# Altium project PMT_8500.PrjPcb
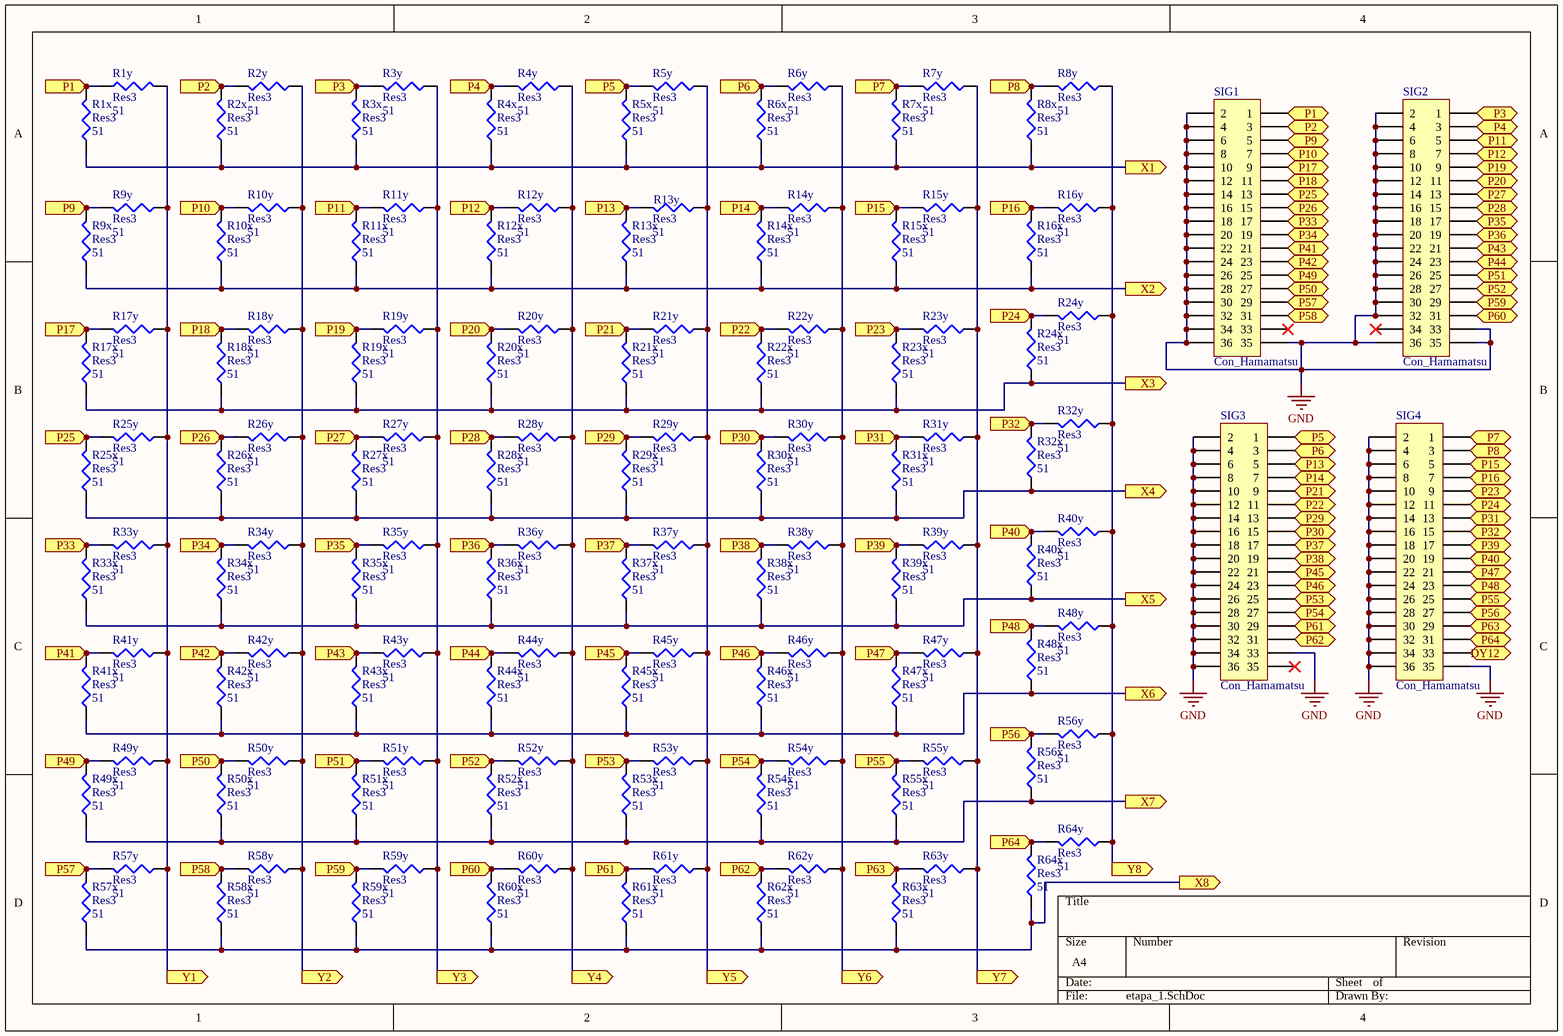
[diagram p0: etapa_1.SchDoc]
4 sheets, 286 parts. Net scope: flat (ports and power ports of the same name join across sheets).
Board file: etapa_1_v2.PcbDoc
Sheets:
  etapa_1.SchDoc
  etapa1_suma.SchDoc
  etapa1_anger_X.SchDoc
  etapa1_anger_Y.SchDoc

## Sheet etapa_1.SchDoc
size A4

### Parts
R1x  Res3  value 51  [0402]
R1y  Res3  value 51  [0402]
R2x  Res3  value 51  [0402]
R2y  Res3  value 51  [0402]
R3x  Res3  value 51  [0402]
R3y  Res3  value 51  [0402]
R4x  Res3  value 51  [0402]
R4y  Res3  value 51  [0402]
R5x  Res3  value 51  [0402]
R5y  Res3  value 51  [0402]
R6x  Res3  value 51  [0402]
R6y  Res3  value 51  [0402]
R7x  Res3  value 51  [0402]
R7y  Res3  value 51  [0402]
R8x  Res3  value 51  [0402]
R8y  Res3  value 51  [0402]
R9x  Res3  value 51  [0402]
R9y  Res3  value 51  [0402]
R10x  Res3  value 51  [0402]
R10y  Res3  value 51  [0402]
R11x  Res3  value 51  [0402]
R11y  Res3  value 51  [0402]
R12x  Res3  value 51  [0402]
R12y  Res3  value 51  [0402]
R13x  Res3  value 51  [0402]
R13y  Res3  value 51  [0402]
R14x  Res3  value 51  [0402]
R14y  Res3  value 51  [0402]
R15x  Res3  value 51  [0402]
R15y  Res3  value 51  [0402]
R16x  Res3  value 51  [0402]
R16y  Res3  value 51  [0402]
R17x  Res3  value 51  [0402]
R17y  Res3  value 51  [0402]
R18x  Res3  value 51  [0402]
R18y  Res3  value 51  [0402]
R19x  Res3  value 51  [0402]
R19y  Res3  value 51  [0402]
R20x  Res3  value 51  [0402]
R20y  Res3  value 51  [0402]
R21x  Res3  value 51  [0402]
R21y  Res3  value 51  [0402]
R22x  Res3  value 51  [0402]
R22y  Res3  value 51  [0402]
R23x  Res3  value 51  [0402]
R23y  Res3  value 51  [0402]
R24x  Res3  value 51  [0402]
R24y  Res3  value 51  [0402]
R25x  Res3  value 51  [0402]
R25y  Res3  value 51  [0402]
R26x  Res3  value 51  [0402]
R26y  Res3  value 51  [0402]
R27x  Res3  value 51  [0402]
R27y  Res3  value 51  [0402]
R28x  Res3  value 51  [0402]
R28y  Res3  value 51  [0402]
R29x  Res3  value 51  [0402]
R29y  Res3  value 51  [0402]
R30x  Res3  value 51  [0402]
R30y  Res3  value 51  [0402]
R31x  Res3  value 51  [0402]
R31y  Res3  value 51  [0402]
R32x  Res3  value 51  [0402]
R32y  Res3  value 51  [0402]
R33x  Res3  value 51  [0402]
R33y  Res3  value 51  [0402]
R34x  Res3  value 51  [0402]
R34y  Res3  value 51  [0402]
R35x  Res3  value 51  [0402]
R35y  Res3  value 51  [0402]
R36x  Res3  value 51  [0402]
R36y  Res3  value 51  [0402]
R37x  Res3  value 51  [0402]
R37y  Res3  value 51  [0402]
R38x  Res3  value 51  [0402]
R38y  Res3  value 51  [0402]
R39x  Res3  value 51  [0402]
R39y  Res3  value 51  [0402]
R40x  Res3  value 51  [0402]
R40y  Res3  value 51  [0402]
R41x  Res3  value 51  [0402]
R41y  Res3  value 51  [0402]
R42x  Res3  value 51  [0402]
R42y  Res3  value 51  [0402]
R43x  Res3  value 51  [0402]
R43y  Res3  value 51  [0402]
R44x  Res3  value 51  [0402]
R44y  Res3  value 51  [0402]
R45x  Res3  value 51  [0402]
R45y  Res3  value 51  [0402]
R46x  Res3  value 51  [0402]
R46y  Res3  value 51  [0402]
R47x  Res3  value 51  [0402]
R47y  Res3  value 51  [0402]
R48x  Res3  value 51  [0402]
R48y  Res3  value 51  [0402]
R49x  Res3  value 51  [0402]
R49y  Res3  value 51  [0402]
R50x  Res3  value 51  [0402]
R50y  Res3  value 51  [0402]
R51x  Res3  value 51  [0402]
R51y  Res3  value 51  [0402]
R52x  Res3  value 51  [0402]
R52y  Res3  value 51  [0402]
R53x  Res3  value 51  [0402]
R53y  Res3  value 51  [0402]
R54x  Res3  value 51  [0402]
R54y  Res3  value 51  [0402]
R55x  Res3  value 51  [0402]
R55y  Res3  value 51  [0402]
R56x  Res3  value 51  [0402]
R56y  Res3  value 51  [0402]
R57x  Res3  value 51  [0402]
R57y  Res3  value 51  [0402]
R58x  Res3  value 51  [0402]
R58y  Res3  value 51  [0402]
R59x  Res3  value 51  [0402]
R59y  Res3  value 51  [0402]
R60x  Res3  value 51  [0402]
R60y  Res3  value 51  [0402]
R61x  Res3  value 51  [0402]
R61y  Res3  value 51  [0402]
R62x  Res3  value 51  [0402]
R62y  Res3  value 51  [0402]
R63x  Res3  value 51  [0402]
R63y  Res3  value 51  [0402]
R64x  Res3  value 51  [0402]
R64y  Res3  value 51  [0402]
SIG1  Con_Hamamatsu  [SQW-118-2]
SIG2  Con_Hamamatsu  [SQW-118-2]
SIG3  Con_Hamamatsu  [SQW-118-2]
SIG4  Con_Hamamatsu  [SQW-118-2]

### Ports
DY12 (out), P1 (in), P1 (out), P2 (in), P2 (out), P3 (in), P3 (out), P4 (in), P4 (out), P5 (in), P5 (out), P6 (in), P6 (out), P7 (in), P7 (out), P8 (in), P8 (out), P9 (in), P9 (out), P10 (in), P10 (out), P11 (in), P11 (out), P12 (in), P12 (out), P13 (in), P13 (out), P14 (in), P14 (out), P15 (in), P15 (out), P16 (in), P16 (out), P17 (in), P17 (out), P18 (in), P18 (out), P19 (in), P19 (out), P20 (in), P20 (out), P21 (in), P21 (out), P22 (in), P22 (out), P23 (in), P23 (out), P24 (in), P24 (out), P25 (in), P25 (out), P26 (in), P26 (out), P27 (in), P27 (out), P28 (in), P28 (out), P29 (in), P29 (out), P30 (in), P30 (out), P31 (in), P31 (out), P32 (in), P32 (out), P33 (in), P33 (out), P34 (in), P34 (out), P35 (in), P35 (out), P36 (in), P36 (out), P37 (in), P37 (out), P38 (in), P38 (out), P39 (in), P39 (out), P40 (in), P40 (out), P41 (in), P41 (out), P42 (in), P42 (out), P43 (in), P43 (out), P44 (in), P44 (out), P45 (in), P45 (out), P46 (in), P46 (out), P47 (in), P47 (out), P48 (in), P48 (out), P49 (in), P49 (out), P50 (in), P50 (out), P51 (in), P51 (out), P52 (in), P52 (out), P53 (in), P53 (out), P54 (in), P54 (out), P55 (in), P55 (out), P56 (in), P56 (out), P57 (in), P57 (out), P58 (in), P58 (out), P59 (in), P59 (out), P60 (in), P60 (out), P61 (in), P61 (out), P62 (in), P62 (out), P63 (in), P63 (out), P64 (in), P64 (out), X1 (out), X2 (out), X3 (out), X4 (out), X5 (out), X6 (out), X7 (out), X8 (out), Y1 (out), Y2 (out), Y3 (out), Y4 (out), Y5 (out), Y6 (out), Y7 (out), Y8 (out)

### Nets
GND: SIG1.2 SIG1.4 SIG1.6 SIG1.8 SIG1.10 SIG1.12 SIG1.14 SIG1.16 SIG1.18 SIG1.20 SIG1.22 SIG1.24 SIG1.26 SIG1.28 SIG1.30 SIG1.32 SIG1.34 SIG1.35 SIG1.36 SIG2.2 SIG2.4 SIG2.6 SIG2.8 SIG2.10 SIG2.12 SIG2.14 SIG2.16 SIG2.18 SIG2.20 SIG2.22 SIG2.24 SIG2.26 SIG2.28 SIG2.30 SIG2.32 SIG2.33 SIG2.35 SIG2.36 SIG3.2 SIG3.4 SIG3.6 SIG3.8 SIG3.10 SIG3.12 SIG3.14 SIG3.16 SIG3.18 SIG3.20 SIG3.22 SIG3.24 SIG3.26 SIG3.28 SIG3.30 SIG3.32 SIG3.33 SIG3.34 SIG3.36 SIG4.2 SIG4.4 SIG4.6 SIG4.8 SIG4.10 SIG4.12 SIG4.14 SIG4.16 SIG4.18 SIG4.20 SIG4.22 SIG4.24 SIG4.26 SIG4.28 SIG4.30 SIG4.32 SIG4.34 SIG4.35 SIG4.36
NetR1_1: R1x.1 R2x.1 R3x.1 R4x.1 R5x.1 R6x.1 R7x.1 R8x.1 ; port X1
NetR1x_2: R1x.2 R1y.1 SIG1.1 ; port P1
NetR1y_2: R1y.2 R9y.1 R17y.1 R25y.1 R33y.1 R41y.1 R49y.1 R57y.1 ; port Y1
NetR2_1: R9x.1 R10x.1 R11x.1 R12x.1 R13x.1 R14x.1 R15x.1 R16x.1 ; port X2
NetR2x_2: R2x.2 R2y.2 SIG1.3 ; port P2
NetR2y_1: R2y.1 R10y.1 R18y.1 R26y.1 R34y.1 R42y.1 R50y.1 R58y.1 ; port Y2
NetR3_1: R17x.1 R18x.1 R19x.1 R20x.1 R21x.1 R22x.1 R23x.1 R24x.1 ; port X3
NetR3x_2: R3x.2 R3y.2 SIG2.1 ; port P3
NetR3y_1: R3y.1 R11y.1 R19y.1 R27y.1 R35y.1 R43y.1 R51y.1 R59y.1 ; port Y3
NetR4_1: R25x.1 R26x.1 R27x.1 R28x.1 R29x.1 R30x.1 R31x.1 R32x.1 ; port X4
NetR4x_2: R4x.2 R4y.2 SIG2.3 ; port P4
NetR4y_1: R4y.1 R12y.1 R20y.1 R28y.1 R36y.1 R44y.1 R52y.1 R60y.1 ; port Y4
NetR5_1: R33x.1 R34x.1 R35x.1 R36x.1 R37x.1 R38x.1 R39x.1 R40x.1 ; port X5
NetR5x_2: R5x.2 R5y.2 SIG3.1 ; port P5
NetR5y_1: R5y.1 R13y.1 R21y.1 R29y.1 R37y.1 R45y.1 R53y.1 R61y.1 ; port Y5
NetR6_1: R41x.1 R42x.1 R43x.1 R44x.1 R45x.1 R46x.1 R47x.1 R48x.1 ; port X6
NetR6x_2: R6x.2 R6y.2 SIG3.3 ; port P6
NetR6y_1: R6y.1 R14y.1 R22y.1 R30y.1 R38y.1 R46y.1 R54y.1 R62y.1 ; port Y6
NetR7_1: R49x.1 R50x.1 R51x.1 R52x.1 R53x.1 R54x.1 R55x.1 R56x.1 ; port X7
NetR7x_2: R7x.2 R7y.2 SIG4.1 ; port P7
NetR7y_1: R7y.1 R15y.1 R23y.1 R31y.1 R39y.1 R47y.1 R55y.1 R63y.1 ; port Y7
NetR8_1: R57x.1 R58x.1 R59x.1 R60x.1 R61x.1 R62x.1 R63x.1 R64x.1 ; port X8
NetR8x_2: R8x.2 R8y.2 SIG4.3 ; port P8
NetR8y_1: R8y.1 R16y.1 R24y.1 R32y.1 R40y.1 R48y.1 R56y.1 R64y.1 ; port Y8
NetR9x_2: R9x.2 R9y.2 SIG1.5 ; port P9
NetR10x_2: R10x.2 R10y.2 SIG1.7 ; port P10
NetR11x_2: R11x.2 R11y.2 SIG2.5 ; port P11
NetR12x_2: R12x.2 R12y.2 SIG2.7 ; port P12
NetR13x_2: R13x.2 R13y.2 SIG3.5 ; port P13
NetR14x_2: R14x.2 R14y.2 SIG3.7 ; port P14
NetR15x_2: R15x.2 R15y.2 SIG4.5 ; port P15
NetR16x_2: R16x.2 R16y.2 SIG4.7 ; port P16
NetR17_2: SIG4.33 ; port DY12
NetR17x_2: R17x.2 R17y.2 SIG1.9 ; port P17
NetR18x_2: R18x.2 R18y.2 SIG1.11 ; port P18
NetR19x_2: R19x.2 R19y.2 SIG2.9 ; port P19
NetR20x_2: R20x.2 R20y.2 SIG2.11 ; port P20
NetR21x_2: R21x.2 R21y.2 SIG3.9 ; port P21
NetR22x_2: R22x.2 R22y.2 SIG3.11 ; port P22
NetR23x_2: R23x.2 R23y.2 SIG4.9 ; port P23
NetR24x_2: R24x.2 R24y.2 SIG4.11 ; port P24
NetR25x_2: R25x.2 R25y.2 SIG1.13 ; port P25
NetR26x_2: R26x.2 R26y.2 SIG1.15 ; port P26
NetR27x_2: R27x.2 R27y.2 SIG2.13 ; port P27
NetR28x_2: R28x.2 R28y.2 SIG2.15 ; port P28
NetR29x_2: R29x.2 R29y.2 SIG3.13 ; port P29
NetR30x_2: R30x.2 R30y.2 SIG3.15 ; port P30
NetR31x_2: R31x.2 R31y.2 SIG4.13 ; port P31
NetR32x_2: R32x.2 R32y.2 SIG4.15 ; port P32
NetR33x_2: R33x.2 R33y.2 SIG1.17 ; port P33
NetR34x_2: R34x.2 R34y.2 SIG1.19 ; port P34
NetR35x_2: R35x.2 R35y.2 SIG2.17 ; port P35
NetR36x_2: R36x.2 R36y.2 SIG2.19 ; port P36
NetR37x_2: R37x.2 R37y.2 SIG3.17 ; port P37
NetR38x_2: R38x.2 R38y.2 SIG3.19 ; port P38
NetR39x_2: R39x.2 R39y.2 SIG4.17 ; port P39
NetR40x_2: R40x.2 R40y.2 SIG4.19 ; port P40
NetR41x_2: R41x.2 R41y.2 SIG1.21 ; port P41
NetR42x_2: R42x.2 R42y.2 SIG1.23 ; port P42
NetR43x_2: R43x.2 R43y.2 SIG2.21 ; port P43
NetR44x_2: R44x.2 R44y.2 SIG2.23 ; port P44
NetR45x_2: R45x.2 R45y.2 SIG3.21 ; port P45
NetR46x_2: R46x.2 R46y.2 SIG3.23 ; port P46
NetR47x_2: R47x.2 R47y.2 SIG4.21 ; port P47
NetR48x_2: R48x.2 R48y.2 SIG4.23 ; port P48
NetR49x_2: R49x.2 R49y.2 SIG1.25 ; port P49
NetR50x_2: R50x.2 R50y.2 SIG1.27 ; port P50
NetR51x_2: R51x.2 R51y.2 SIG2.25 ; port P51
NetR52x_2: R52x.2 R52y.2 SIG2.27 ; port P52
NetR53x_2: R53x.2 R53y.2 SIG3.25 ; port P53
NetR54x_2: R54x.2 R54y.2 SIG3.27 ; port P54
NetR55x_2: R55x.2 R55y.2 SIG4.25 ; port P55
NetR56x_2: R56x.2 R56y.2 SIG4.27 ; port P56
NetR57x_2: R57x.2 R57y.2 SIG1.29 ; port P57
NetR58x_2: R58x.2 R58y.2 SIG1.31 ; port P58
NetR59x_2: R59x.2 R59y.2 SIG2.29 ; port P59
NetR60x_2: R60x.2 R60y.2 SIG2.31 ; port P60
NetR61x_2: R61x.2 R61y.2 SIG3.29 ; port P61
NetR62x_2: R62x.2 R62y.2 SIG3.31 ; port P62
NetR63x_2: R63x.2 R63y.2 SIG4.29 ; port P63
NetR64x_2: R64x.2 R64y.2 SIG4.31 ; port P64

Not connected (* = marked no-connect by the designer): SIG1 33*; SIG2 34*; SIG3 35*

### Library data of the parts
R1x R1y R2x R2y R3x R3y R4x R4y R5x R5y R6x R6y R7x R7y R8x R8y R9x R9y R10x R10y R11x R11y R12x R12y R13x R13y R14x R14y R15x R15y R16x R16y R17x R17y R18x R18y R19x R19y R20x R20y R21x R21y R22x R22y R23x R23y R24x R24y R25x R25y R26x R26y R27x R27y R28x R28y R29x R29y R30x R30y R31x R31y R32x R32y R33x R33y R34x R34y R35x R35y R36x R36y R37x R37y R38x R38y R39x R39y R40x R40y R41x R41y R42x R42y R43x R43y R44x R44y R45x R45y R46x R46y R47x R47y R48x R48y R49x R49y R50x R50y R51x R51y R52x R52y R53x R53y R54x R54y R55x R55y R56x R56y R57x R57y R58x R58y R59x R59y R60x R60y R61x R61y R62x R62y R63x R63y R64x R64y = Res3: Resistor; Published: 8-Jun-2000; LatestRevisionDate: 29-May-2009; LatestRevisionNote: IPC-7351 Footprint Added.; PackageReference: J1-0603; Publisher: Altium Limited; PackageDescription: Chip Resistor

## Sheet etapa1_suma.SchDoc
size A4
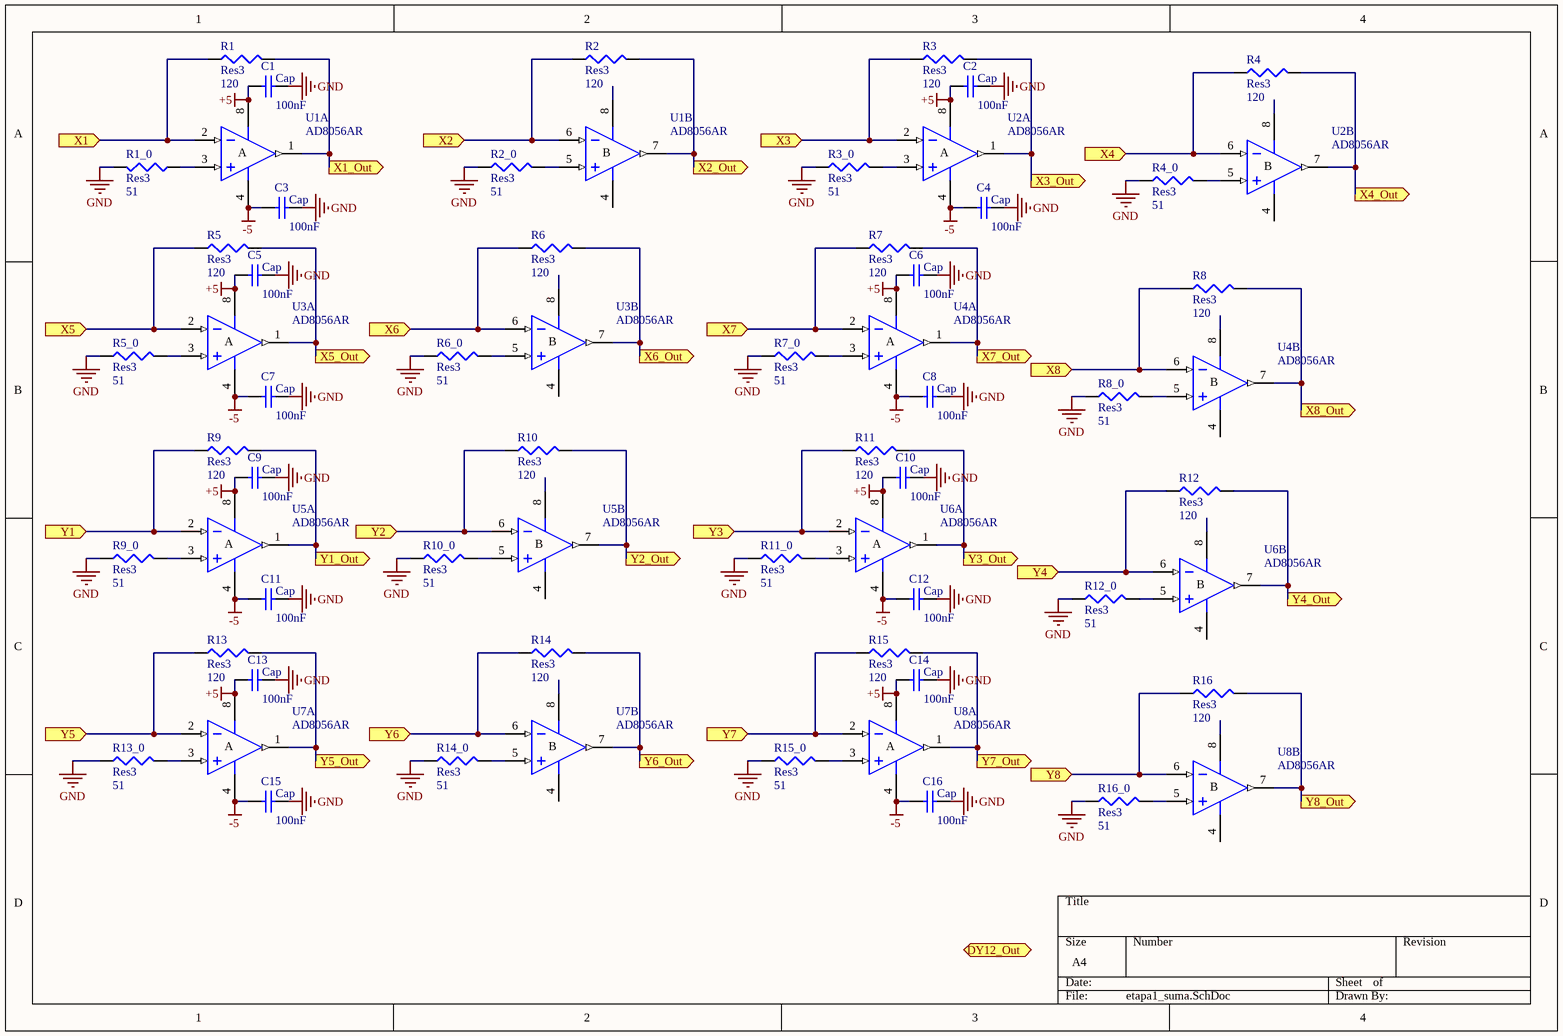
[diagram p1: etapa1_suma.SchDoc]

### Parts
C1  Cap  value 100nF  [1608[0603]]
C2  Cap  value 100nF  [1608[0603]]
C3  Cap  value 100nF  [1608[0603]]
C4  Cap  value 100nF  [1608[0603]]
C5  Cap  value 100nF  [1608[0603]]
C6  Cap  value 100nF  [1608[0603]]
C7  Cap  value 100nF  [1608[0603]]
C8  Cap  value 100nF  [1608[0603]]
C9  Cap  value 100nF  [1608[0603]]
C10  Cap  value 100nF  [1608[0603]]
C11  Cap  value 100nF  [1608[0603]]
C12  Cap  value 100nF  [1608[0603]]
C13  Cap  value 100nF  [1608[0603]]
C14  Cap  value 100nF  [1608[0603]]
C15  Cap  value 100nF  [1608[0603]]
C16  Cap  value 100nF  [1608[0603]]
R1  Res3  value 120  [0402]
R1_0  Res3  value 51  [0402]
R2  Res3  value 120  [0402]
R2_0  Res3  value 51  [0402]
R3  Res3  value 120  [0402]
R3_0  Res3  value 51  [0402]
R4  Res3  value 120  [0402]
R4_0  Res3  value 51  [0402]
R5  Res3  value 120  [0402]
R5_0  Res3  value 51  [0402]
R6  Res3  value 120  [0402]
R6_0  Res3  value 51  [0402]
R7  Res3  value 120  [0402]
R7_0  Res3  value 51  [0402]
R8  Res3  value 120  [0402]
R8_0  Res3  value 51  [0402]
R9  Res3  value 120  [0402]
R9_0  Res3  value 51  [0402]
R10  Res3  value 120  [0402]
R10_0  Res3  value 51  [0402]
R11  Res3  value 120  [0402]
R11_0  Res3  value 51  [0402]
R12  Res3  value 120  [0402]
R12_0  Res3  value 51  [0402]
R13  Res3  value 120  [0402]
R13_0  Res3  value 51  [0402]
R14  Res3  value 120  [0402]
R14_0  Res3  value 51  [0402]
R15  Res3  value 120  [0402]
R15_0  Res3  value 51  [0402]
R16  Res3  value 120  [0402]
R16_0  Res3  value 51  [0402]
U1  AD8056AR  [RM-8]  (parts A,B of 2)
U2  AD8056AR  [RM-8]  (parts A,B of 2)
U3  AD8056AR  [RM-8]  (parts A,B of 2)
U4  AD8056AR  [RM-8]  (parts A,B of 2)
U5  AD8056AR  [RM-8]  (parts A,B of 2)
U6  AD8056AR  [RM-8]  (parts A,B of 2)
U7  AD8056AR  [RM-8]  (parts A,B of 2)
U8  AD8056AR  [RM-8]  (parts A,B of 2)

### Ports
DY12_Out (out), X1 (in), X1_Out (out), X2 (in), X2_Out (out), X3 (in), X3_Out (out), X4 (in), X4_Out (out), X5 (in), X5_Out (out), X6 (in), X6_Out (out), X7 (in), X7_Out (out), X8 (in), X8_Out (out), Y1 (in), Y1_Out (out), Y2 (in), Y2_Out (out), Y3 (in), Y3_Out (out), Y4 (in), Y4_Out (out), Y5 (in), Y5_Out (out), Y6 (in), Y6_Out (out), Y7 (in), Y7_Out (out), Y8 (in), Y8_Out (out)

### Nets
+5: C1.2 C2.2 C5.2 C6.2 C9.2 C10.2 C13.2 C14.2 U1.8(V+) U2.8(V+) U3.8(V+) U4.8(V+) U5.8(V+) U6.8(V+) U7.8(V+) U8.8(V+)
-5: C3.2 C4.2 C7.2 C8.2 C11.2 C12.2 C15.2 C16.2 U1.4(V-) U2.4(V-) U3.4(V-) U4.4(V-) U5.4(V-) U6.4(V-) U7.4(V-) U8.4(V-)
GND: C1.1 C2.1 C3.1 C4.1 C5.1 C6.1 C7.1 C8.1 C9.1 C10.1 C11.1 C12.1 C13.1 C14.1 C15.1 C16.1 R1_0.2 R2_0.1 R3_0.1 R4_0.1 R5_0.1 R6_0.1 R7_0.1 R8_0.1 R9_0.1 R10_0.1 R11_0.1 R12_0.1 R13_0.1 R14_0.1 R15_0.1 R16_0.1
NetR1_0_1: R1_0.1 U1.3(IN+)
NetR1_1: R1.1 U1.2(IN-) ; port X1
NetR1_2: R1.2 U1.1(OUT) ; port X1_Out
NetR1y_2: R9.1 U5.2(IN-) ; port Y1
NetR2_0_2: R2_0.2 U1.5(IN+)
NetR2_1: R2.1 U1.6(IN-) ; port X2
NetR2_2: R2.2 U1.7(OUT) ; port X2_Out
NetR2y_1: R10.1 U5.6(IN-) ; port Y2
NetR3_0_2: R3_0.2 U2.3(IN+)
NetR3_1: R3.1 U2.2(IN-) ; port X3
NetR3_2: R3.2 U2.1(OUT) ; port X3_Out
NetR3y_1: R11.1 U6.2(IN-) ; port Y3
NetR4_0_2: R4_0.2 U2.5(IN+)
NetR4_1: R4.1 U2.6(IN-) ; port X4
NetR4_2: R4.2 U2.7(OUT) ; port X4_Out
NetR4y_1: R12.1 U6.6(IN-) ; port Y4
NetR5_0_2: R5_0.2 U3.3(IN+)
NetR5_1: R5.1 U3.2(IN-) ; port X5
NetR5_2: R5.2 U3.1(OUT) ; port X5_Out
NetR5y_1: R13.1 U7.2(IN-) ; port Y5
NetR6_0_2: R6_0.2 U3.5(IN+)
NetR6_1: R6.1 U3.6(IN-) ; port X6
NetR6_2: R6.2 U3.7(OUT) ; port X6_Out
NetR6y_1: R14.1 U7.6(IN-) ; port Y6
NetR7_0_2: R7_0.2 U4.3(IN+)
NetR7_1: R7.1 U4.2(IN-) ; port X7
NetR7_2: R7.2 U4.1(OUT) ; port X7_Out
NetR7y_1: R15.1 U8.2(IN-) ; port Y7
NetR8_0_2: R8_0.2 U4.5(IN+)
NetR8_1: R8.1 U4.6(IN-) ; port X8
NetR8_2: R8.2 U4.7(OUT) ; port X8_Out
NetR8y_1: R16.1 U8.6(IN-) ; port Y8
NetR9_0_2: R9_0.2 U5.3(IN+)
NetR9_2: R9.2 U5.1(OUT) ; port Y1_Out
NetR10_0_2: R10_0.2 U5.5(IN+)
NetR10_2: R10.2 U5.7(OUT) ; port Y2_Out
NetR11_0_2: R11_0.2 U6.3(IN+)
NetR11_2: R11.2 U6.1(OUT) ; port Y3_Out
NetR12_0_2: R12_0.2 U6.5(IN+)
NetR12_2: R12.2 U6.7(OUT) ; port Y4_Out
NetR13_0_2: R13_0.2 U7.3(IN+)
NetR13_2: R13.2 U7.1(OUT) ; port Y5_Out
NetR14_0_2: R14_0.2 U7.5(IN+)
NetR14_2: R14.2 U7.7(OUT) ; port Y6_Out
NetR15_0_2: R15_0.2 U8.3(IN+)
NetR15_2: R15.2 U8.1(OUT) ; port Y7_Out
NetR16_0_2: R16_0.2 U8.5(IN+)
NetR16_2: R16.2 U8.7(OUT) ; port Y8_Out

### Notes on the sheet
- (in symbol AD8056AR, part A) A
- (in symbol AD8056AR, part B) B

### Library data of the parts
C1-C16 = Cap: Capacitor; Published: 8-Jun-2000; LatestRevisionDate: 17-Jul-2002; LatestRevisionNote: Re-released for DXP Platform.; PackageReference: RAD-0.3; Publisher: Altium Limited; PackageDescription: Radial Cap, Thru-Hole; 2 Leads; 0.3 in Pin Spacing
R1 R1_0 R2 R2_0 R3 R3_0 R4 R4_0 R5 R5_0 R6 R6_0 R7 R7_0 R8 R8_0 R9 R9_0 R10 R10_0 R11 R11_0 R12 R12_0 R13 R13_0 R14 R14_0 R15 R15_0 R16 R16_0 = Res3: Resistor; Published: 8-Jun-2000; LatestRevisionDate: 29-May-2009; LatestRevisionNote: IPC-7351 Footprint Added.; PackageReference: J1-0603; Publisher: Altium Limited; PackageDescription: Chip Resistor
U1-U8 = AD8056AR: Low Cost, 300MHz Voltage Feedback Amplifier; Published: 8-Jun-2000; LatestRevisionDate: 13-Apr-2006; LatestRevisionNote: IPC-7351 Footprint Added.; DatasheetVersion: REV. 0 1997; PackageVersion: revA; PackageReference: SO-8; Publisher: Altium Limited; PackageDescription: 8-Pin Small Outline Integrated Circuit 1.27 mm Pitch; Code_JEDEC: MS-012-AA; Code_IPC: SOIC127P600-8; ComponentLink1Description: Manufacturer Link; ComponentLink1URL: http://www.analog.com/en/prod/0,,759_786_AD8055%2C00.html; ComponentLink2Description: Datasheet; ComponentLink2URL: http://www.analog.com/UploadedFiles/Data_Sheets/40402558757264AD8055_6_i.pdf

## Sheet etapa1_anger_X.SchDoc
size A4
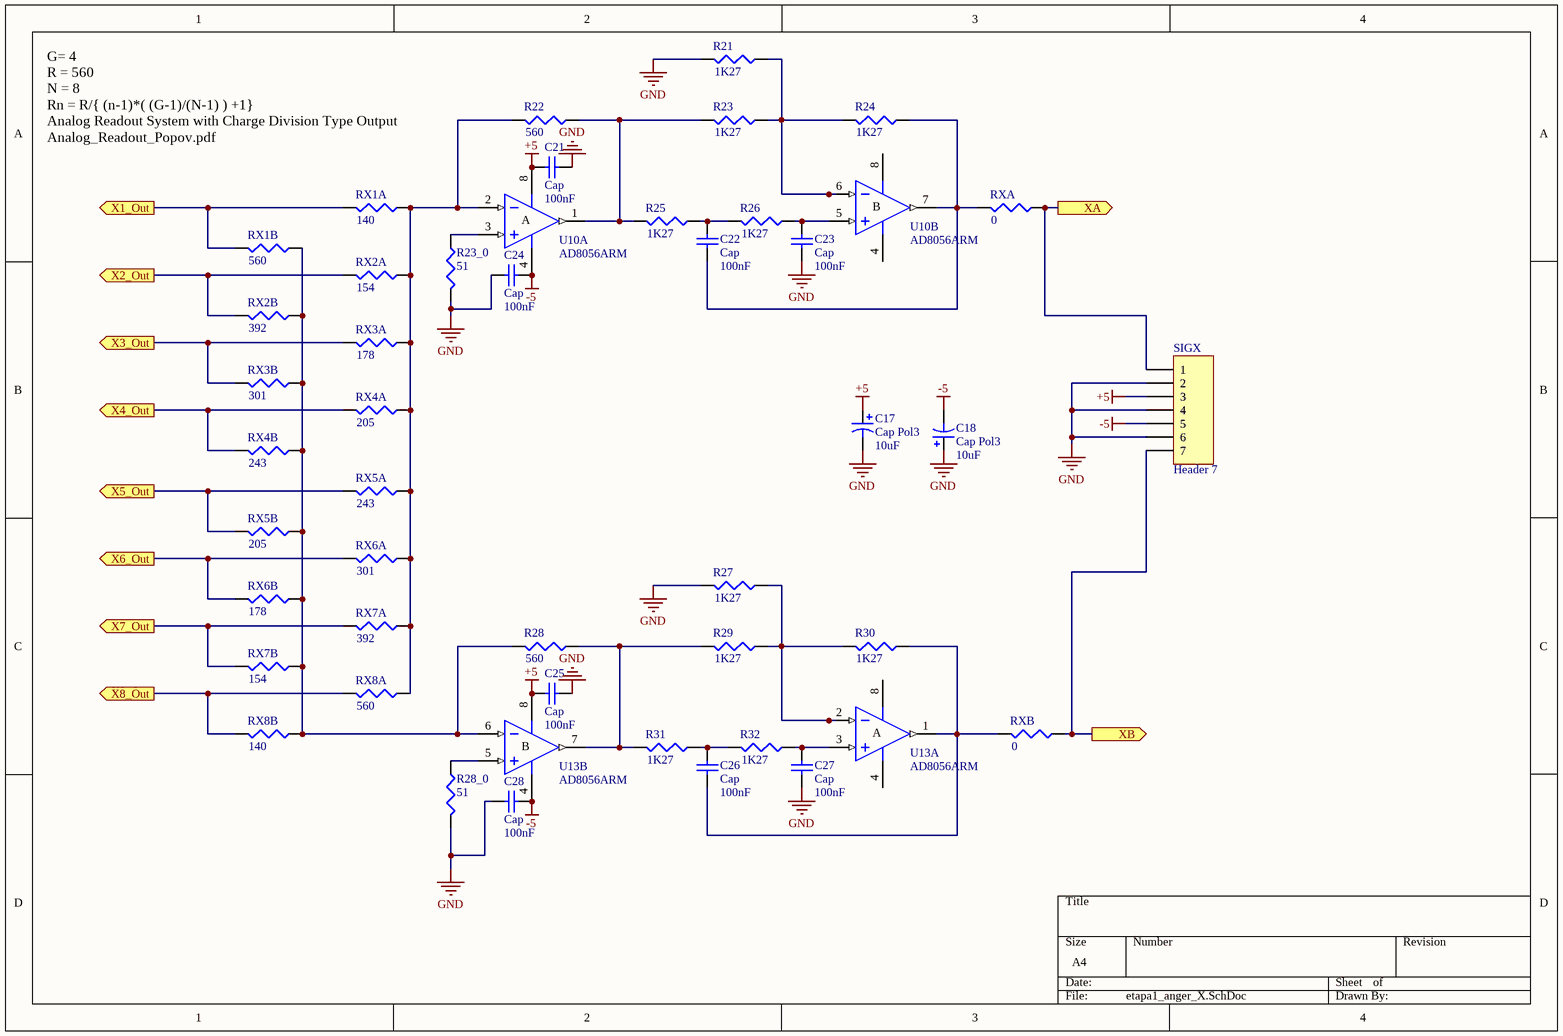
[diagram p2: etapa1_anger_X.SchDoc]

### Parts
C17  Cap Pol3  value 10uF  [C0805]
C18  Cap Pol3  value 10uF  [C0805]
C21  Cap  value 100nF  [1608[0603]]
C22  Cap  value 100nF  [1608[0603]]
C23  Cap  value 100nF  [1608[0603]]
C24  Cap  value 100nF  [1608[0603]]
C25  Cap  value 100nF  [1608[0603]]
C26  Cap  value 100nF  [1608[0603]]
C27  Cap  value 100nF  [1608[0603]]
C28  Cap  value 100nF  [1608[0603]]
R21  value 1K27  [1608[0603]]  (hidden comment: Res3)
R22  value 560  [0402]  (hidden comment: Res3)
R23  value 1K27  [0402]  (hidden comment: Res3)
R23_0  value 51  [0402]  (hidden comment: Res3)
R24  value 1K27  [0402]  (hidden comment: Res3)
R25  value 1K27  [0402]  (hidden comment: Res3)
R26  value 1K27  [0402]  (hidden comment: Res3)
R27  value 1K27  [1608[0603]]  (hidden comment: Res3)
R28  value 560  [0402]  (hidden comment: Res3)
R28_0  value 51  [0402]  (hidden comment: Res3)
R29  value 1K27  [0402]  (hidden comment: Res3)
R30  value 1K27  [0402]  (hidden comment: Res3)
R31  value 1K27  [0402]  (hidden comment: Res3)
R32  value 1K27  [0402]  (hidden comment: Res3)
RX1A  value 140  [0402]  (hidden comment: Res3)
RX1B  value 560  [0402]  (hidden comment: Res3)
RX2A  value 154  [0402]  (hidden comment: Res3)
RX2B  value 392  [0402]  (hidden comment: Res3)
RX3A  value 178  [0402]  (hidden comment: Res3)
RX3B  value 301  [0402]  (hidden comment: Res3)
RX4A  value 205  [0402]  (hidden comment: Res3)
RX4B  value 243  [0402]  (hidden comment: Res3)
RX5A  value 243  [0402]  (hidden comment: Res3)
RX5B  value 205  [0402]  (hidden comment: Res3)
RX6A  value 301  [0402]  (hidden comment: Res3)
RX6B  value 178  [0402]  (hidden comment: Res3)
RX7A  value 392  [0402]  (hidden comment: Res3)
RX7B  value 154  [0402]  (hidden comment: Res3)
RX8A  value 560  [0402]  (hidden comment: Res3)
RX8B  value 140  [0402]  (hidden comment: Res3)
RXA  value 0  [0402]  (hidden comment: Res3)
RXB  value 0  [0402]  (hidden comment: Res3)
SIGX  Header 7  [HDR1X7]
U10  AD8056ARM  [RM-8]  (parts A,B of 2)
U13  AD8056ARM  [RM-8]  (parts A,B of 2)

### Ports
X1_Out (out), X2_Out (out), X3_Out (out), X4_Out (out), X5_Out (out), X6_Out (out), X7_Out (out), X8_Out (out), XA (out), XB (out)

### Nets
+5: C17.1 C21.1 C25.1 SIGX.3 U10.8(V+) U13.8(V+)
-5: C18.2 C24.2 C28.2 SIGX.5 U10.4(V-) U13.4(V-)
GND: C17.2 C18.1 C21.2 C23.2 C24.1 C25.2 C27.2 C28.1 R21.2 R23_0.2 R27.2 R28_0.2 SIGX.2 SIGX.4 SIGX.6
NetC22_1: C22.1 R25.1 R26.2
NetC22_2: C22.2 R24.1 RXA.2 U10.7(OUT)
NetC23_1: C23.1 R26.1 U10.5(IN+)
NetC26_1: C26.1 R31.1 R32.2
NetC26_2: C26.2 R30.1 RXB.2 U13.1(OUT)
NetC27_1: C27.1 R32.1 U13.3(IN+)
NetR1_2: RX1A.2 RX1B.2 ; port X1_Out
NetR2_2: RX2A.2 RX2B.2 ; port X2_Out
NetR3_2: RX3A.2 RX3B.2 ; port X3_Out
NetR4_2: RX4A.2 RX4B.2 ; port X4_Out
NetR5_2: RX5A.2 RX5B.2 ; port X5_Out
NetR6_2: RX6A.2 RX6B.2 ; port X6_Out
NetR7_2: RX7A.2 RX7B.2 ; port X7_Out
NetR8_2: RX8A.2 RX8B.2 ; port X8_Out
NetR21_1: R21.1 R23.1 R24.2 U10.6(IN-)
NetR22_1: R22.1 R23.2 R25.2 U10.1(OUT)
NetR22_2: R22.2 RX1A.1 RX2A.1 RX3A.1 RX4A.1 RX5A.1 RX6A.1 RX7A.1 RX8A.1 U10.2(IN-)
NetR23_0_1: R23_0.1 U10.3(IN+)
NetR27_1: R27.1 R29.1 R30.2 U13.2(IN-)
NetR28_0_1: R28_0.1 U13.5(IN+)
NetR28_1: R28.1 R29.2 R31.2 U13.7(OUT)
NetR28_2: R28.2 RX1B.1 RX2B.1 RX3B.1 RX4B.1 RX5B.1 RX6B.1 RX7B.1 RX8B.1 U13.6(IN-)
NetRXA_1: RXA.1 SIGX.1 ; port XA
NetRXB_1: RXB.1 SIGX.7 ; port XB

### Notes on the sheet
- (near RX1A) G= 4
  R = 560
  N = 8
  Rn = R/{ (n-1)*( (G-1)/(N-1) ) +1}
  Analog Readout System with Charge Division Type Output
  Analog_Readout_Popov.pdf
- (in symbol AD8056ARM, part A) A
- (in symbol AD8056ARM, part B) B

### Library data of the parts
C17 C18 = Cap Pol3: Polarized Capacitor (Surface Mount); Published: 8-Jun-2000; LatestRevisionDate: 29-May-2009; LatestRevisionNote: IPC-7351 Footprint Added.; PackageReference: C0805; Publisher: Altium Limited; PackageDescription: Chip Capacitor
C21-C28 = Cap: Capacitor; Published: 8-Jun-2000; LatestRevisionDate: 17-Jul-2002; LatestRevisionNote: Re-released for DXP Platform.; PackageReference: RAD-0.3; Publisher: Altium Limited; PackageDescription: Radial Cap, Thru-Hole; 2 Leads; 0.3 in Pin Spacing
R21-R23 R23_0 R24-R28 R28_0 R29-R32 RX1A RX1B RX2A RX2B RX3A RX3B RX4A RX4B RX5A RX5B RX6A RX6B RX7A RX7B RX8A RX8B RXA RXB = Res3: Resistor; Published: 8-Jun-2000; LatestRevisionDate: 29-May-2009; LatestRevisionNote: IPC-7351 Footprint Added.; PackageReference: J1-0603; Publisher: Altium Limited; PackageDescription: Chip Resistor
SIGX = Header 7: Header, 7-Pin; LatestRevisionDate: 17-Jul-2002; LatestRevisionNote: Re-released for DXP Platform.; Publisher: Altium Limited
U10 U13 = AD8056ARM: Low Cost, 300MHz Voltage Feedback Amplifier; Published: 8-Jun-2000; LatestRevisionDate: 04-Mar-2005; LatestRevisionNote: Stylized 3D Model Added, PCB footprint pad width decreased.; DatasheetVersion: REV. 0 1997; PackageVersion: 2004; PackageReference: RM-8; Publisher: Altium Limited; PackageDescription: Shrink Small Outline, MSOP; 8 Leads; Body Width 3 mm; Pitch 0.65 mm; Code_JEDEC: MO-187-AA; ComponentLink1Description: Manufacturer Link; ComponentLink1URL: http://www.analog.com/en/prod/0,,759_786_AD8055%2C00.html; ComponentLink2Description: Datasheet; ComponentLink2URL: http://www.analog.com/UploadedFiles/Data_Sheets/40402558757264AD8055_6_i.pdf

## Sheet etapa1_anger_Y.SchDoc
size A4
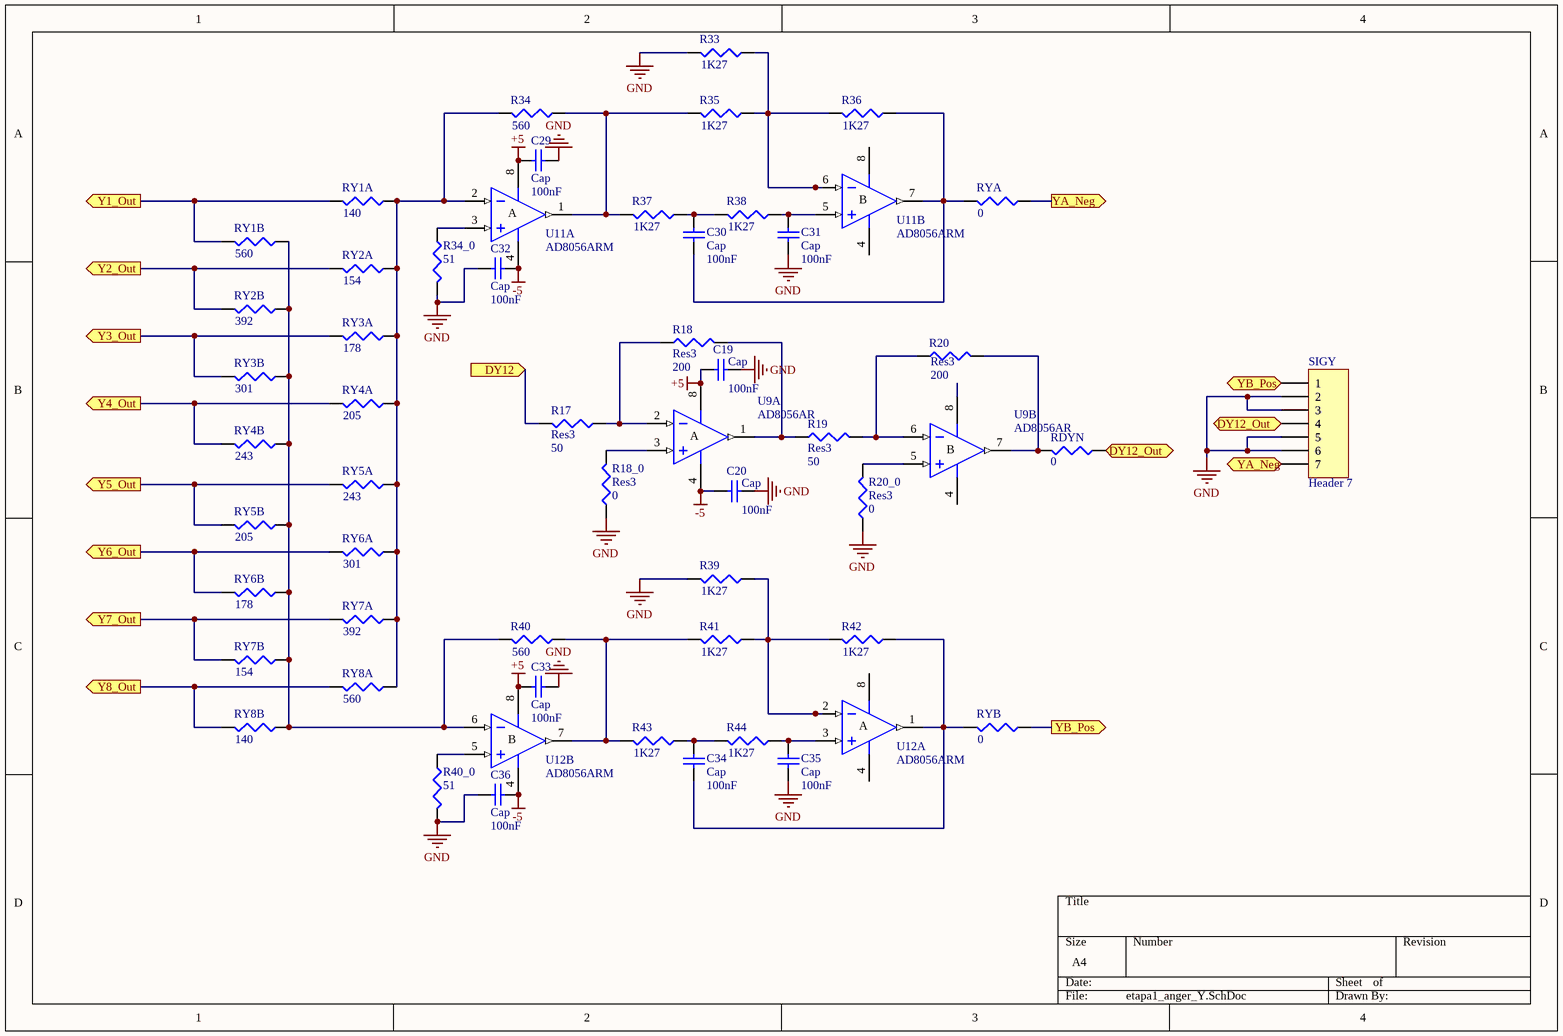
[diagram p3: etapa1_anger_Y.SchDoc]

### Parts
C19  Cap  value 100nF  [1608[0603]]
C20  Cap  value 100nF  [1608[0603]]
C29  Cap  value 100nF  [1608[0603]]
C30  Cap  value 100nF  [1608[0603]]
C31  Cap  value 100nF  [1608[0603]]
C32  Cap  value 100nF  [1608[0603]]
C33  Cap  value 100nF  [1608[0603]]
C34  Cap  value 100nF  [1608[0603]]
C35  Cap  value 100nF  [1608[0603]]
C36  Cap  value 100nF  [1608[0603]]
R17  Res3  value 50  [0402]
R18  Res3  value 200  [0402]
R18_0  Res3  value 0  [0402]
R19  Res3  value 50  [0402]
R20  Res3  value 200  [0402]
R20_0  Res3  value 0  [0402]
R33  value 1K27  [1608[0603]]  (hidden comment: Res3)
R34  value 560  [0402]  (hidden comment: Res3)
R34_0  value 51  [0402]  (hidden comment: Res3)
R35  value 1K27  [0402]  (hidden comment: Res3)
R36  value 1K27  [0402]  (hidden comment: Res3)
R37  value 1K27  [0402]  (hidden comment: Res3)
R38  value 1K27  [0402]  (hidden comment: Res3)
R39  value 1K27  [1608[0603]]  (hidden comment: Res3)
R40  value 560  [0402]  (hidden comment: Res3)
R40_0  value 51  [0402]  (hidden comment: Res3)
R41  value 1K27  [0402]  (hidden comment: Res3)
R42  value 1K27  [0402]  (hidden comment: Res3)
R43  value 1K27  [0402]  (hidden comment: Res3)
R44  value 1K27  [0402]  (hidden comment: Res3)
RDYN  value 0  [0402]  (hidden comment: Res3)
RY1A  value 140  [0402]  (hidden comment: Res3)
RY1B  value 560  [0402]  (hidden comment: Res3)
RY2A  value 154  [0402]  (hidden comment: Res3)
RY2B  value 392  [0402]  (hidden comment: Res3)
RY3A  value 178  [0402]  (hidden comment: Res3)
RY3B  value 301  [0402]  (hidden comment: Res3)
RY4A  value 205  [0402]  (hidden comment: Res3)
RY4B  value 243  [0402]  (hidden comment: Res3)
RY5A  value 243  [0402]  (hidden comment: Res3)
RY5B  value 205  [0402]  (hidden comment: Res3)
RY6A  value 301  [0402]  (hidden comment: Res3)
RY6B  value 178  [0402]  (hidden comment: Res3)
RY7A  value 392  [0402]  (hidden comment: Res3)
RY7B  value 154  [0402]  (hidden comment: Res3)
RY8A  value 560  [0402]  (hidden comment: Res3)
RY8B  value 140  [0402]  (hidden comment: Res3)
RYA  value 0  [0402]  (hidden comment: Res3)
RYB  value 0  [0402]  (hidden comment: Res3)
SIGY  Header 7  [HDR1X7]
U9  AD8056AR  [RM-8]  (parts A,B of 2)
U11  AD8056ARM  [RM-8]  (parts A,B of 2)
U12  AD8056ARM  [RM-8]  (parts A,B of 2)

### Ports
DY12 (in), DY12_Out (out), Y1_Out (out), Y2_Out (out), Y3_Out (out), Y4_Out (out), Y5_Out (out), Y6_Out (out), Y7_Out (out), Y8_Out (out), YA_Neg (out), YB_Pos (out)

### Nets
+5: C19.2 C29.1 C33.1 U9.8(V+) U11.8(V+) U12.8(V+)
-5: C20.2 C32.2 C36.2 U9.4(V-) U11.4(V-) U12.4(V-)
GND: C19.1 C20.1 C29.2 C31.2 C32.1 C33.2 C35.2 C36.1 R18_0.1 R20_0.1 R33.2 R34_0.2 R39.2 R40_0.2 SIGY.2 SIGY.3 SIGY.5 SIGY.6
NetC30_1: C30.1 R37.1 R38.2
NetC30_2: C30.2 R36.1 RYA.2 U11.7(OUT)
NetC31_1: C31.1 R38.1 U11.5(IN+)
NetC34_1: C34.1 R43.1 R44.2
NetC34_2: C34.2 R42.1 RYB.2 U12.1(OUT)
NetC35_1: C35.1 R44.1 U12.3(IN+)
NetR9_2: RY1A.2 RY1B.2 ; port Y1_Out
NetR10_2: RY2A.2 RY2B.2 ; port Y2_Out
NetR11_2: RY3A.2 RY3B.2 ; port Y3_Out
NetR12_2: RY4A.2 RY4B.2 ; port Y4_Out
NetR13_2: RY5A.2 RY5B.2 ; port Y5_Out
NetR14_2: RY6A.2 RY6B.2 ; port Y6_Out
NetR15_2: RY7A.2 RY7B.2 ; port Y7_Out
NetR16_2: RY8A.2 RY8B.2 ; port Y8_Out
NetR17_1: R17.1 R18.1 U9.2(IN-)
NetR17_2: R17.2 ; port DY12
NetR18_0_2: R18_0.2 U9.3(IN+)
NetR18_2: R18.2 R19.1 U9.1(OUT)
NetR19_2: R19.2 R20.1 U9.6(IN-)
NetR20_0_2: R20_0.2 U9.5(IN+)
NetR20_2: R20.2 RDYN.2 U9.7(OUT)
NetR33_1: R33.1 R35.1 R36.2 U11.6(IN-)
NetR34_0_1: R34_0.1 U11.3(IN+)
NetR34_1: R34.1 R35.2 R37.2 U11.1(OUT)
NetR34_2: R34.2 RY1A.1 RY2A.1 RY3A.1 RY4A.1 RY5A.1 RY6A.1 RY7A.1 RY8A.1 U11.2(IN-)
NetR39_1: R39.1 R41.1 R42.2 U12.2(IN-)
NetR40_0_1: R40_0.1 U12.5(IN+)
NetR40_1: R40.1 R41.2 R43.2 U12.7(OUT)
NetR40_2: R40.2 RY1B.1 RY2B.1 RY3B.1 RY4B.1 RY5B.1 RY6B.1 RY7B.1 RY8B.1 U12.6(IN-)
NetRDYN_1: RDYN.1 SIGY.4 ; port DY12_Out
NetRYA_1: RYA.1 SIGY.7 ; port YA_Neg
NetRYB_1: RYB.1 SIGY.1 ; port YB_Pos

### Notes on the sheet
- (in symbol AD8056AR, part A) A
- (in symbol AD8056AR, part B) B
- (in symbol AD8056ARM, part A) A
- (in symbol AD8056ARM, part B) B

### Library data of the parts
C19 C20 C29-C36 = Cap: Capacitor; Published: 8-Jun-2000; LatestRevisionDate: 17-Jul-2002; LatestRevisionNote: Re-released for DXP Platform.; PackageReference: RAD-0.3; Publisher: Altium Limited; PackageDescription: Radial Cap, Thru-Hole; 2 Leads; 0.3 in Pin Spacing
R17 R18 R18_0 R19 R20 R20_0 R33 R34 R34_0 R35-R40 R40_0 R41-R44 RDYN RY1A RY1B RY2A RY2B RY3A RY3B RY4A RY4B RY5A RY5B RY6A RY6B RY7A RY7B RY8A RY8B RYA RYB = Res3: Resistor; Published: 8-Jun-2000; LatestRevisionDate: 29-May-2009; LatestRevisionNote: IPC-7351 Footprint Added.; PackageReference: J1-0603; Publisher: Altium Limited; PackageDescription: Chip Resistor
SIGY = Header 7: Header, 7-Pin; LatestRevisionDate: 17-Jul-2002; LatestRevisionNote: Re-released for DXP Platform.; Publisher: Altium Limited
U9 = AD8056AR: as U1 on sheet etapa1_suma; Published: 8-Jun-2000; LatestRevisionDate: 13-Apr-2006; LatestRevisionNote: IPC-7351 Footprint Added.; DatasheetVersion: REV. 0 1997; PackageVersion: revA; PackageReference: SO-8; Publisher: Altium Limited; PackageDescription: 8-Pin Small Outline Integrated Circuit 1.27 mm Pitch; Code_JEDEC: MS-012-AA; Code_IPC: SOIC127P600-8; ComponentLink1Description: Manufacturer Link; ComponentLink1URL: http://www.analog.com/en/prod/0,,759_786_AD8055%2C00.html; ComponentLink2Description: Datasheet; ComponentLink2URL: http://www.analog.com/UploadedFiles/Data_Sheets/40402558757264AD8055_6_i.pdf
U11 U12 = AD8056ARM: as U10 on sheet etapa1_anger_X; Published: 8-Jun-2000; LatestRevisionDate: 04-Mar-2005; LatestRevisionNote: Stylized 3D Model Added, PCB footprint pad width decreased.; DatasheetVersion: REV. 0 1997; PackageVersion: 2004; PackageReference: RM-8; Publisher: Altium Limited; PackageDescription: Shrink Small Outline, MSOP; 8 Leads; Body Width 3 mm; Pitch 0.65 mm; Code_JEDEC: MO-187-AA; ComponentLink1Description: Manufacturer Link; ComponentLink1URL: http://www.analog.com/en/prod/0,,759_786_AD8055%2C00.html; ComponentLink2Description: Datasheet; ComponentLink2URL: http://www.analog.com/UploadedFiles/Data_Sheets/40402558757264AD8055_6_i.pdf

## Nets that join several sheets
+5: etapa1_suma (16 pins), etapa1_anger_X (6 pins), etapa1_anger_Y (6 pins)
-5: etapa1_suma (16 pins), etapa1_anger_X (6 pins), etapa1_anger_Y (6 pins)
GND: etapa_1 (76 pins), etapa1_suma (32 pins), etapa1_anger_X (15 pins), etapa1_anger_Y (18 pins)
NetR1_1: etapa_1 (8 pins), etapa1_suma (R1.1 U1.2)
NetR1_2: etapa1_suma (R1.2 U1.1), etapa1_anger_X (RX1A.2 RX1B.2)
NetR1y_2: etapa_1 (8 pins), etapa1_suma (R9.1 U5.2)
NetR2_1: etapa_1 (8 pins), etapa1_suma (R2.1 U1.6)
NetR2_2: etapa1_suma (R2.2 U1.7), etapa1_anger_X (RX2A.2 RX2B.2)
NetR2y_1: etapa_1 (8 pins), etapa1_suma (R10.1 U5.6)
NetR3_1: etapa_1 (8 pins), etapa1_suma (R3.1 U2.2)
NetR3_2: etapa1_suma (R3.2 U2.1), etapa1_anger_X (RX3A.2 RX3B.2)
NetR3y_1: etapa_1 (8 pins), etapa1_suma (R11.1 U6.2)
NetR4_1: etapa_1 (8 pins), etapa1_suma (R4.1 U2.6)
NetR4_2: etapa1_suma (R4.2 U2.7), etapa1_anger_X (RX4A.2 RX4B.2)
NetR4y_1: etapa_1 (8 pins), etapa1_suma (R12.1 U6.6)
NetR5_1: etapa_1 (8 pins), etapa1_suma (R5.1 U3.2)
NetR5_2: etapa1_suma (R5.2 U3.1), etapa1_anger_X (RX5A.2 RX5B.2)
NetR5y_1: etapa_1 (8 pins), etapa1_suma (R13.1 U7.2)
NetR6_1: etapa_1 (8 pins), etapa1_suma (R6.1 U3.6)
NetR6_2: etapa1_suma (R6.2 U3.7), etapa1_anger_X (RX6A.2 RX6B.2)
NetR6y_1: etapa_1 (8 pins), etapa1_suma (R14.1 U7.6)
NetR7_1: etapa_1 (8 pins), etapa1_suma (R7.1 U4.2)
NetR7_2: etapa1_suma (R7.2 U4.1), etapa1_anger_X (RX7A.2 RX7B.2)
NetR7y_1: etapa_1 (8 pins), etapa1_suma (R15.1 U8.2)
NetR8_1: etapa_1 (8 pins), etapa1_suma (R8.1 U4.6)
NetR8_2: etapa1_suma (R8.2 U4.7), etapa1_anger_X (RX8A.2 RX8B.2)
NetR8y_1: etapa_1 (8 pins), etapa1_suma (R16.1 U8.6)
NetR9_2: etapa1_suma (R9.2 U5.1), etapa1_anger_Y (RY1A.2 RY1B.2)
NetR10_2: etapa1_suma (R10.2 U5.7), etapa1_anger_Y (RY2A.2 RY2B.2)
NetR11_2: etapa1_suma (R11.2 U6.1), etapa1_anger_Y (RY3A.2 RY3B.2)
NetR12_2: etapa1_suma (R12.2 U6.7), etapa1_anger_Y (RY4A.2 RY4B.2)
NetR13_2: etapa1_suma (R13.2 U7.1), etapa1_anger_Y (RY5A.2 RY5B.2)
NetR14_2: etapa1_suma (R14.2 U7.7), etapa1_anger_Y (RY6A.2 RY6B.2)
NetR15_2: etapa1_suma (R15.2 U8.1), etapa1_anger_Y (RY7A.2 RY7B.2)
NetR16_2: etapa1_suma (R16.2 U8.7), etapa1_anger_Y (RY8A.2 RY8B.2)
NetR17_2: etapa_1 (SIG4.33), etapa1_anger_Y (R17.2)